# EAGLE schematic screw-front-a-1 (EAGLE 9.6.2)
AUTHOR: Balazs Racz; DRAWING_TITLE: MEB Schalterwerk Projekt; LICENSE: Licensed by the Solderpad Hardware License V2.0; REVIEWER: n/a; REVISION: A5; YEAR: 2023
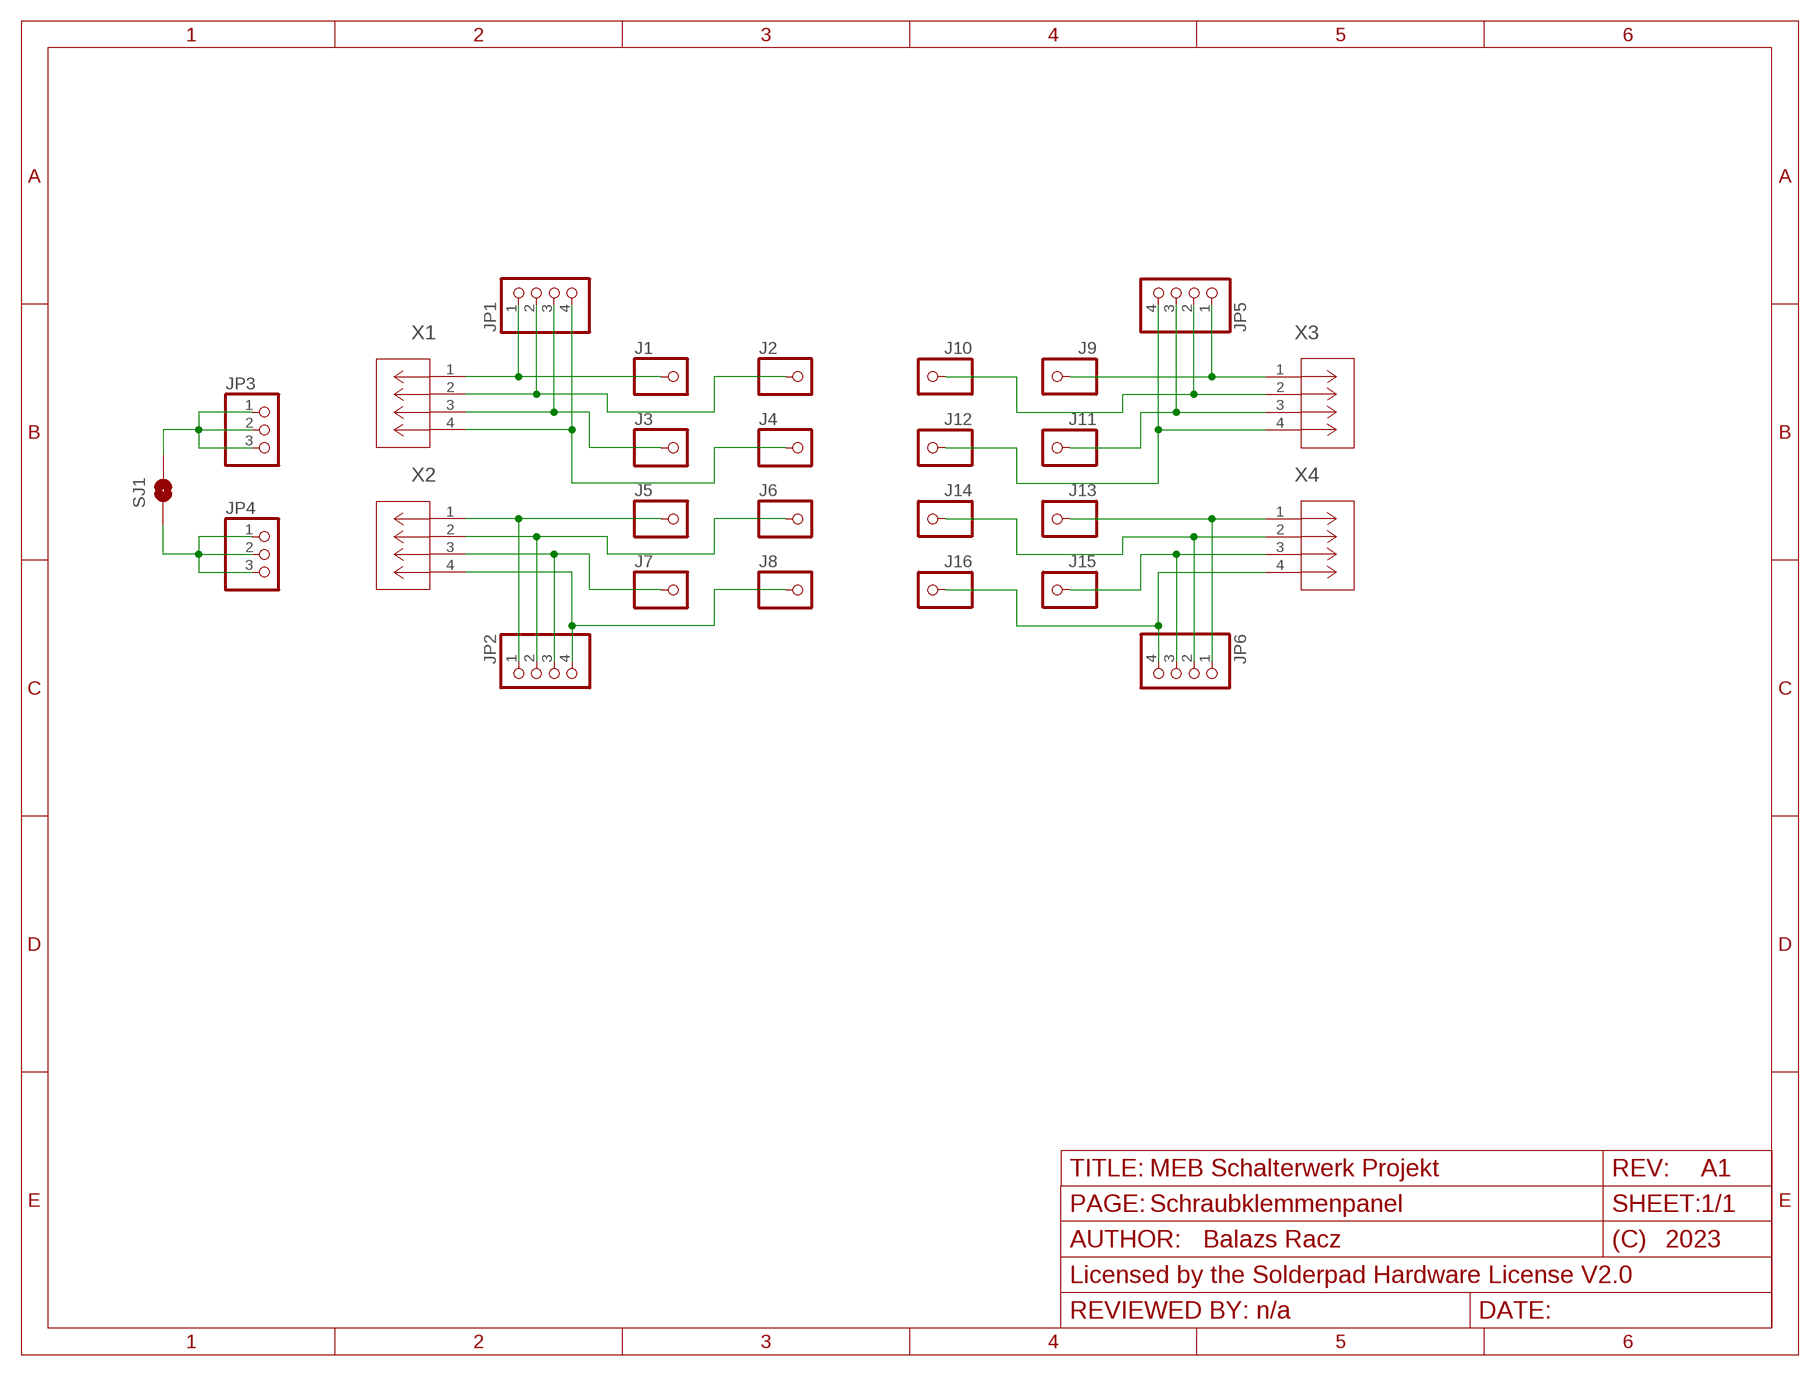
[diagram p0: schematic, sheet 1]
FRAME1 (FRAME_A_L): PAGE: Input ports
FRAME2 (FRAME_A_L): PAGE: Schraubklemmenpanel; REVISION: A1

## Parts
J1  M4-SCREW-HOLE  [M4-SCREW-HOLE]
J2  M4-SCREW-HOLE  [M4-SCREW-HOLE]
J3  M4-SCREW-HOLE  [M4-SCREW-HOLE]
J4  M4-SCREW-HOLE  [M4-SCREW-HOLE]
J5  M4-SCREW-HOLE  [M4-SCREW-HOLE]
J6  M4-SCREW-HOLE  [M4-SCREW-HOLE]
J7  M4-SCREW-HOLE  [M4-SCREW-HOLE]
J8  M4-SCREW-HOLE  [M4-SCREW-HOLE]
J9  M4-SCREW-HOLE  [M4-SCREW-HOLE]
J10  M4-SCREW-HOLE  [M4-SCREW-HOLE]
J11  M4-SCREW-HOLE  [M4-SCREW-HOLE]
J12  M4-SCREW-HOLE  [M4-SCREW-HOLE]
J13  M4-SCREW-HOLE  [M4-SCREW-HOLE]
J14  M4-SCREW-HOLE  [M4-SCREW-HOLE]
J15  M4-SCREW-HOLE  [M4-SCREW-HOLE]
J16  M4-SCREW-HOLE  [M4-SCREW-HOLE]
JP1  PINHD-1X4  [1X04]
JP2  PINHD-1X4  [1X04]
JP3  PINHD-1X3  [1X03]
JP4  PINHD-1X3  [1X03]
JP5  PINHD-1X4  [1X04]
JP6  PINHD-1X4  [1X04]
SJ1  SJRND2  [SJ_RND2]
X1  PHNX_4P_350CONN_1984989_PXC  [PHNX_4P_350]
X2  PHNX_4P_350CONN_1984989_PXC  [PHNX_4P_350]
X3  PHNX_4P_350CONN_1984989_PXC  [PHNX_4P_350]
X4  PHNX_4P_350CONN_1984989_PXC  [PHNX_4P_350]

## Nets
N$1: J1.P$1 JP1.1 X1.1
N$2: J2.P$1 JP1.2 X1.2
N$3: J3.P$1 JP1.3 X1.3
N$4: J4.P$1 JP1.4 X1.4
N$5: J5.P$1 JP2.1 X2.1
N$6: J6.P$1 JP2.2 X2.2
N$7: J7.P$1 JP2.3 X2.3
N$8: J8.P$1 JP2.4 X2.4
N$9: JP3.1 JP3.2 JP3.3 SJ1.P$2
N$10: JP4.1 JP4.2 JP4.3 SJ1.P$1
N$11: J9.P$1 JP5.1 X3.1
N$12: J10.P$1 JP5.2 X3.2
N$13: J11.P$1 JP5.3 X3.3
N$14: J12.P$1 JP5.4 X3.4
N$15: J13.P$1 JP6.1 X4.1
N$16: J14.P$1 JP6.2 X4.2
N$17: J15.P$1 JP6.3 X4.3
N$18: J16.P$1 JP6.4 X4.4

## Library data of the parts
J1-J16 = eagleparts:M4-SCREW-HOLE
JP1 JP2 JP5 JP6 = pinhead:PINHD-1X4: PIN HEADER
JP3 JP4 = pinhead:PINHD-1X3: PIN HEADER
SJ1 = eagleparts:SJ: SMD solder JUMPER
X1-X4 = eagleparts:PHNX_4P_350: https://www.digikey.com/en/products/detail/phoenix-contact/1984989/2513979 DigiKey 277-6404-ND; COPYRIGHT: Copyright (C) 2023 Ultra Librarian. All rights reserved.; MANUFACTURER_PART_NUMBER: 1984989; MFR_NAME: Phoenix Contact